# Altium schematic sheet RUMBA_V2.SchDoc
size 609 x 406 mm; PageSetup: Record=PageOptions|CenterHorizontal=True|CenterVertical=True|PrintScale=0.68|XCorrection=1.00|YCorrection=1.00|PrintKind=1|BorderSize=5000000|LeftOffset=0|BottomOffset=0|Orientation=2|PaperLength=1000|PaperWidth=1000|Scale=100|PaperSource=7|PrintQuality=-4|MediaType=1|DitherType=10|PaperKind=A3|PrintScaleMode=1
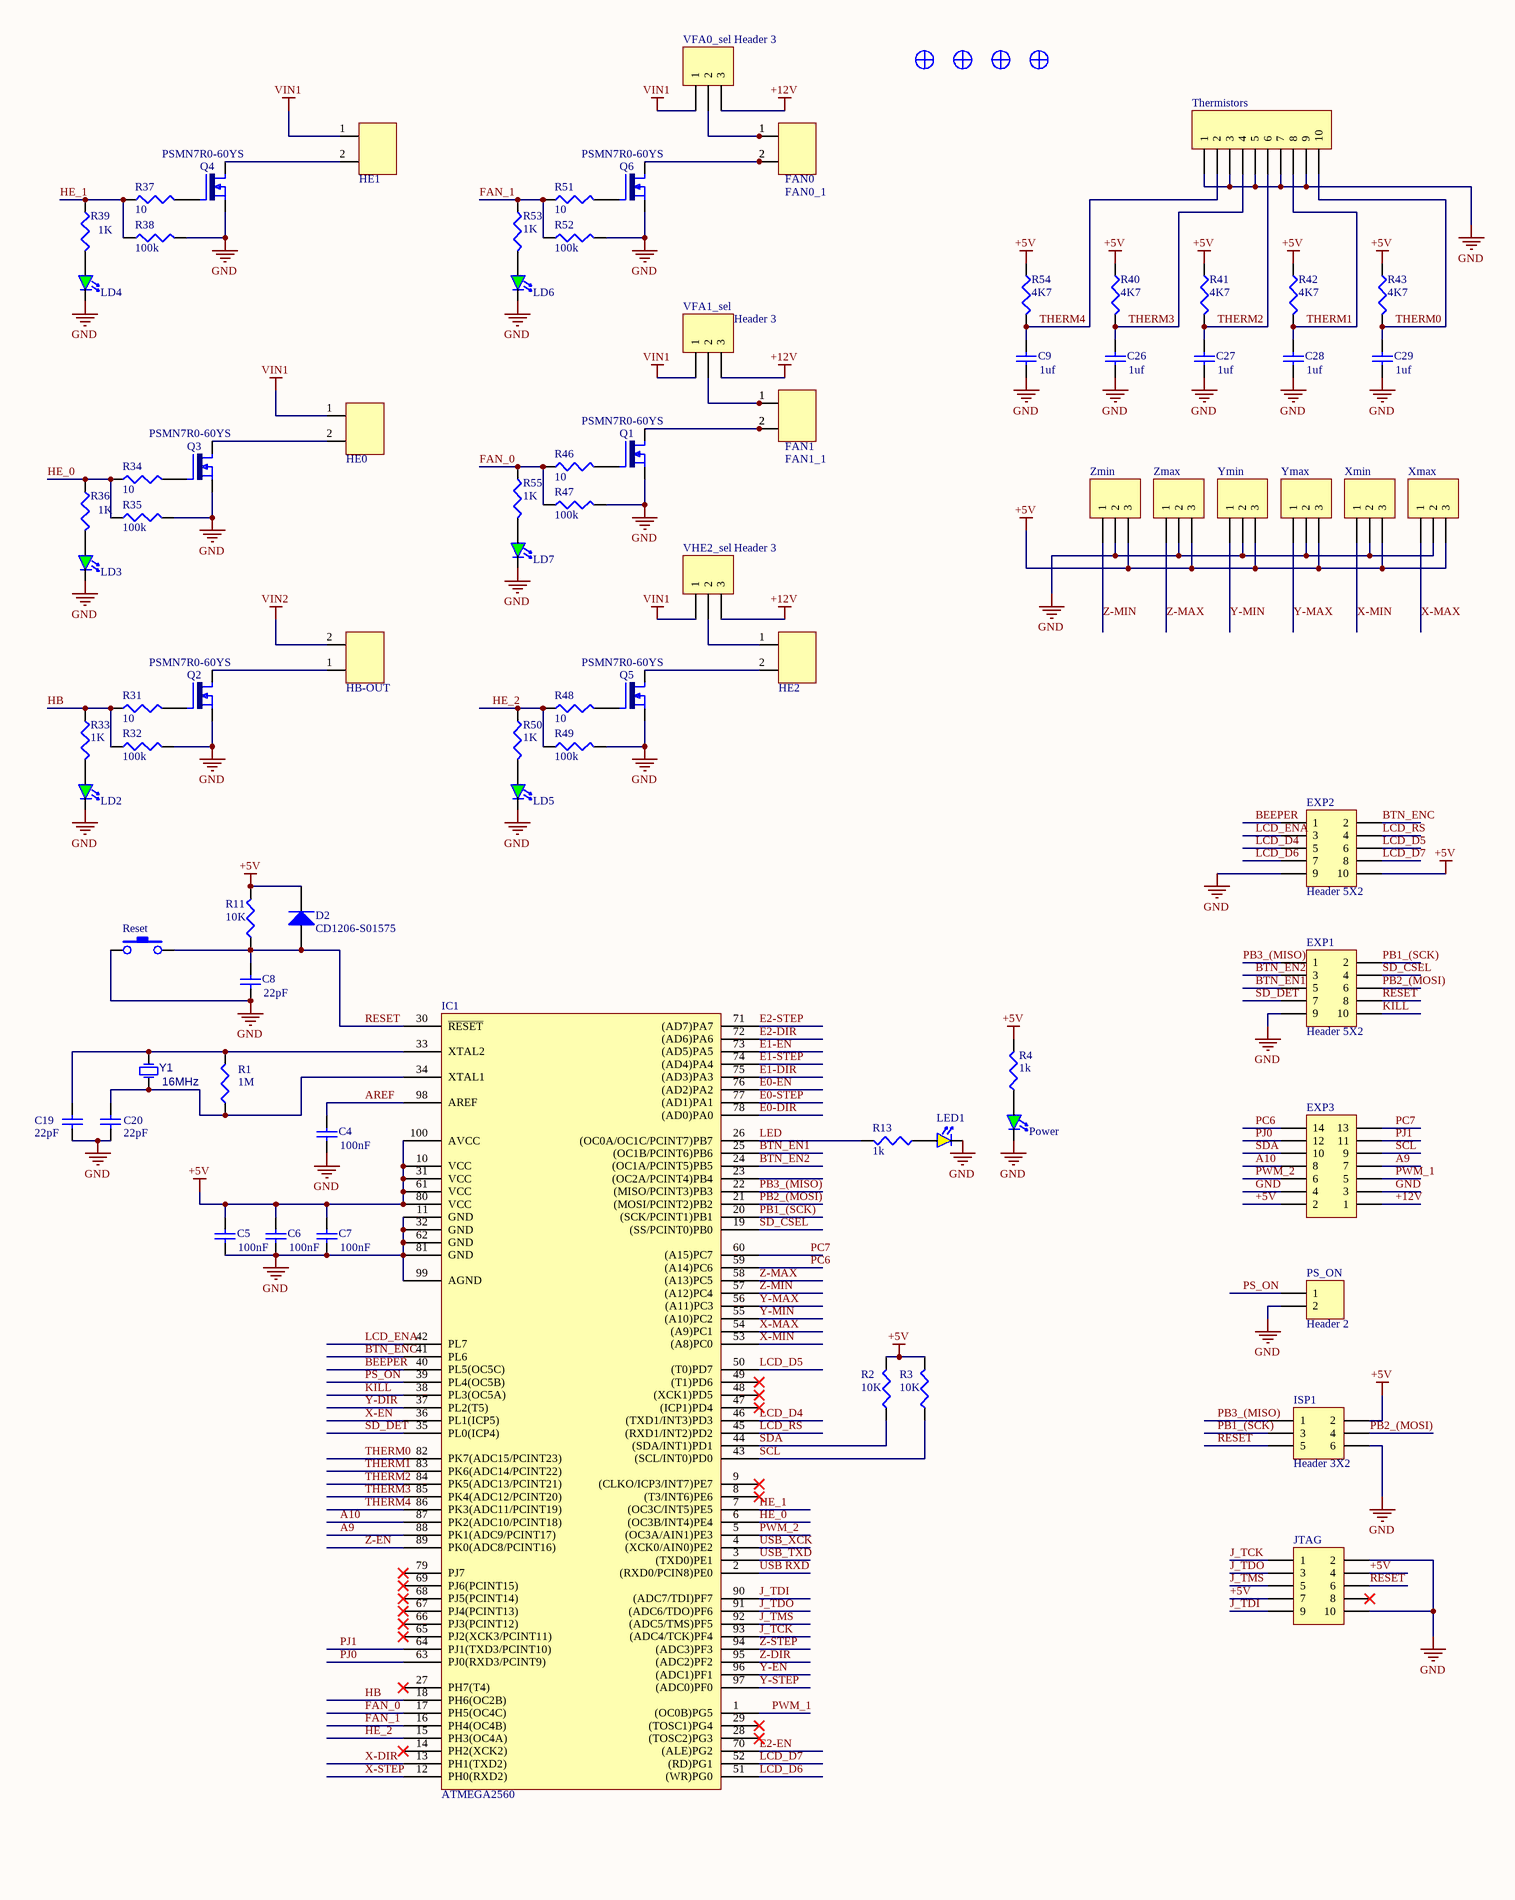
[diagram p0: RUMBA_V2.SchDoc, left]
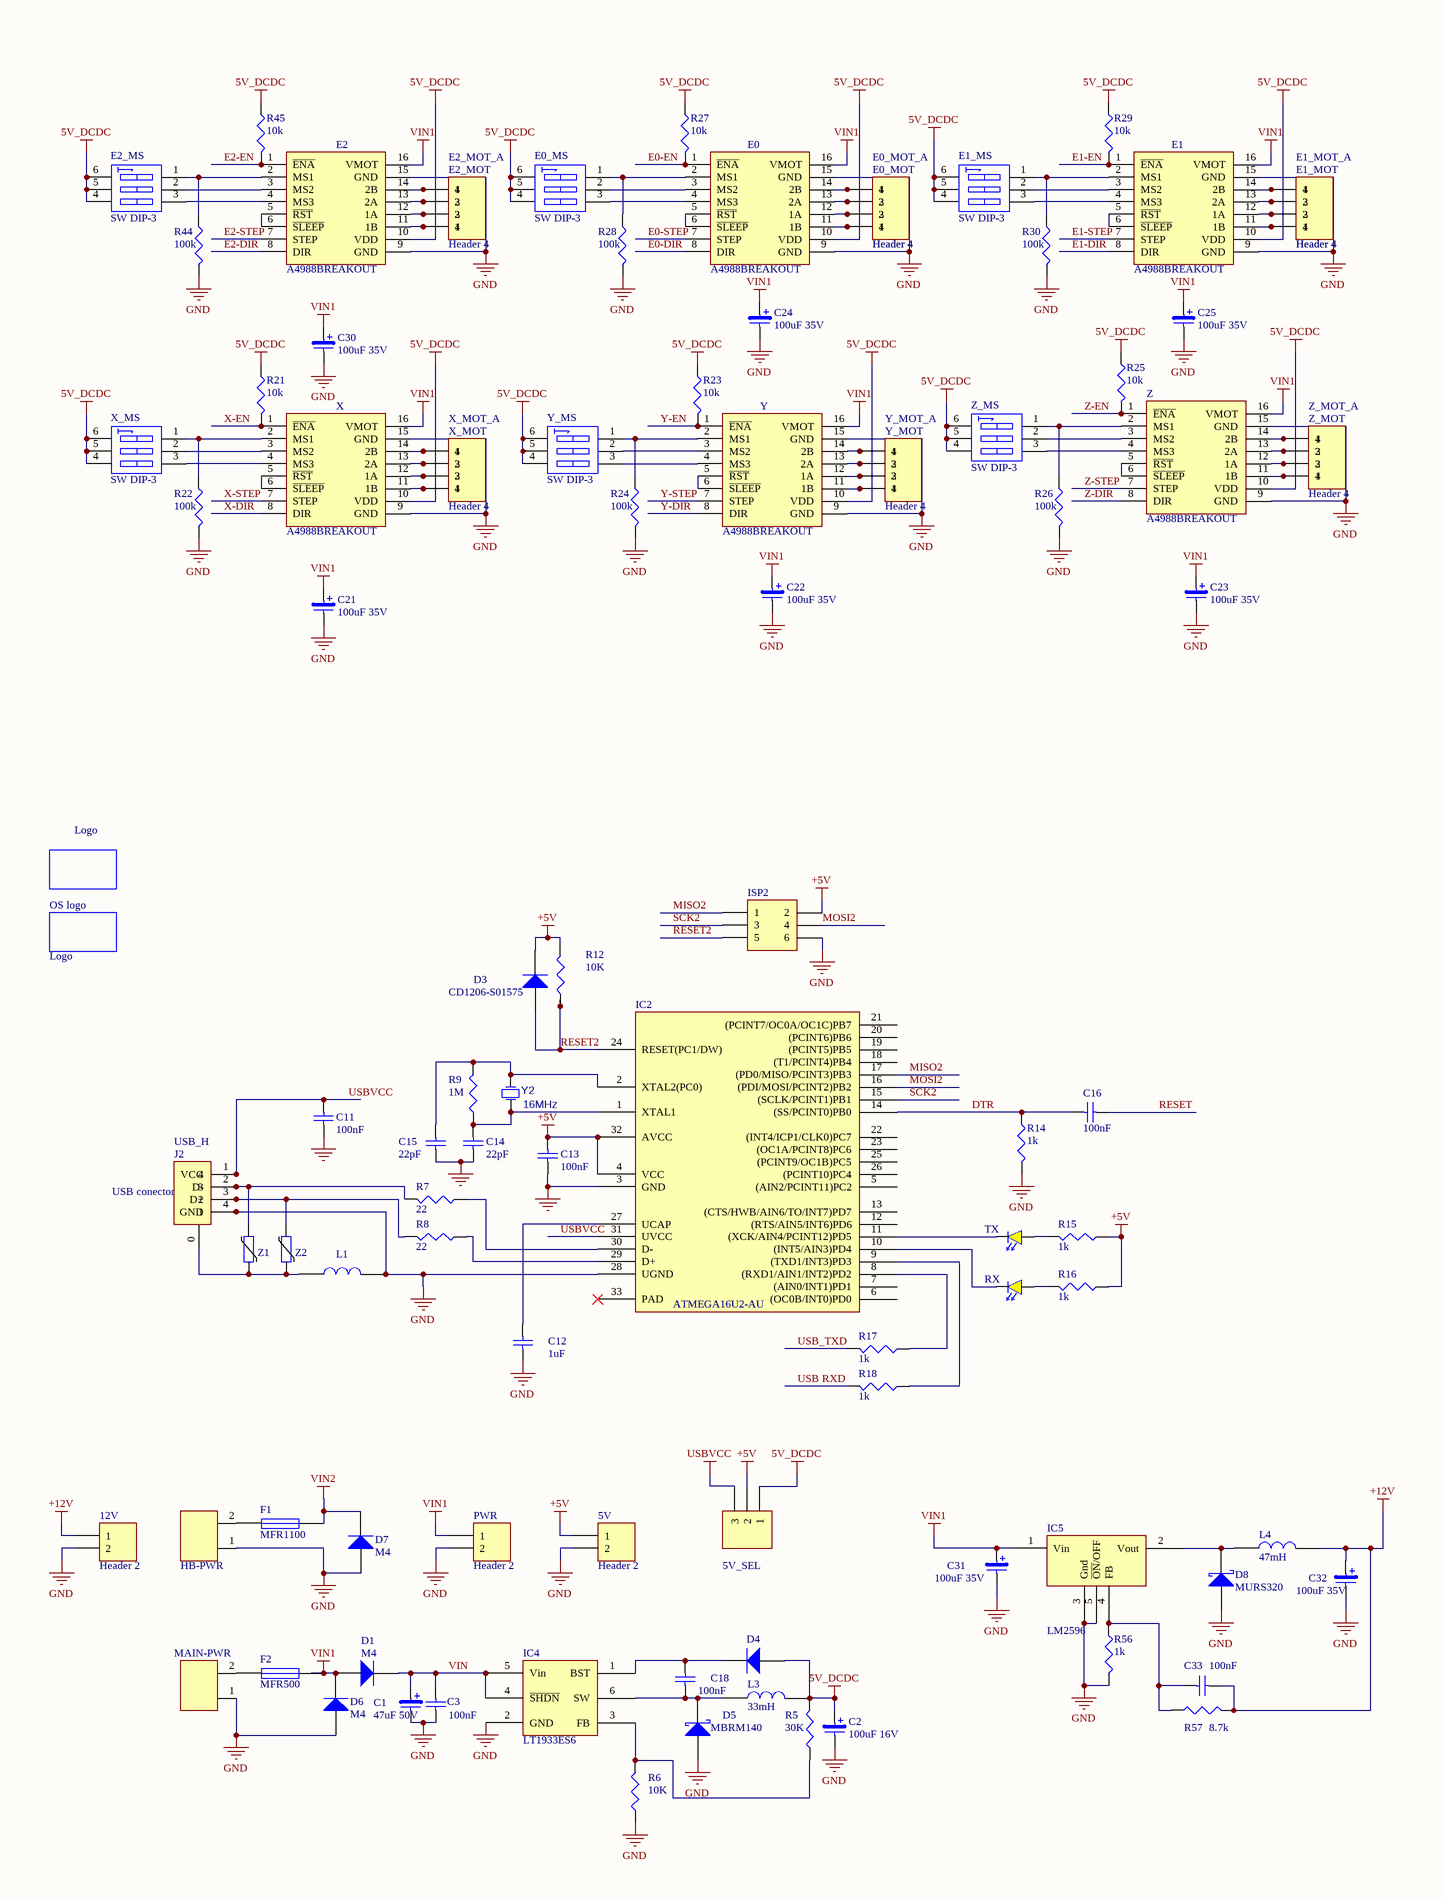
[diagram p1: RUMBA_V2.SchDoc, right]

## Parts
5V  Header 2  [HDR1X2]
5V_SEL  Header 3  [HDR1X3]  (value not drawn)
12V  Header 2  [HDR1X2]
C1  value 47uF 50V  [CAP EL PANASONIC]  (hidden comment: Cap Pol3)
C2  value 100uF 16V  [CAP EL PANASONIC]  (hidden comment: Cap Pol3)
C3  value 100nF  [Cap 1608-0603]  (hidden comment: Cap Semi)
C4  value 100nF  [Cap 1608-0603]  (hidden comment: Cap Semi)
C5  value 100nF  [Cap 1608-0603]  (hidden comment: Cap Semi)
C6  value 100nF  [Cap 1608-0603]  (hidden comment: Cap Semi)
C7  value 100nF  [Cap 1608-0603]  (hidden comment: Cap Semi)
C8  value 22pF  [Cap 1608-0603]  (hidden comment: Cap Semi)
C9  value 1uf  [Cap2012-0805]  (hidden comment: Cap Semi)
C11  value 100nF  [Cap 1608-0603]  (hidden comment: Cap Semi)
C12  value 1uF  [Cap 1608-0603]  (hidden comment: Cap Semi)
C13  value 100nF  [Cap 1608-0603]  (hidden comment: Cap Semi)
C14  value 22pF  [Cap 1608-0603]  (hidden comment: Cap Semi)
C15  value 22pF  [Cap 1608-0603]  (hidden comment: Cap Semi)
C16  value 100nF  [Cap 1608-0603]  (hidden comment: Cap Semi)
C18  value 100nF  [Cap 1608-0603]  (hidden comment: Cap Semi)
C19  value 22pF  [Cap 1608-0603]  (hidden comment: Cap Semi)
C20  value 22pF  [Cap 1608-0603]  (hidden comment: Cap Semi)
C21  value 100uF 35V  [CAP EL PANASONIC]  (hidden comment: Cap Pol3)
C22  value 100uF 35V  [CAP EL PANASONIC]  (hidden comment: Cap Pol3)
C23  value 100uF 35V  [CAP EL PANASONIC]  (hidden comment: Cap Pol3)
C24  value 100uF 35V  [CAP EL PANASONIC]  (hidden comment: Cap Pol3)
C25  value 100uF 35V  [CAP EL PANASONIC]  (hidden comment: Cap Pol3)
C26  value 1uf  [Cap2012-0805]  (hidden comment: Cap Semi)
C27  value 1uf  [Cap2012-0805]  (hidden comment: Cap Semi)
C28  value 1uf  [Cap2012-0805]  (hidden comment: Cap Semi)
C29  value 1uf  [Cap2012-0805]  (hidden comment: Cap Semi)
C30  value 100uF 35V  [CAP EL PANASONIC]  (hidden comment: Cap Pol3)
C31  value 100uF 35V  [CAP EL PANASONIC]  (hidden comment: Cap Pol3)
C32  value 100uF 35V  [CAP EL PANASONIC]  (hidden comment: Cap Pol3)
C33  value 100nF  [Cap 1608-0603]  (hidden comment: Cap Semi)
D1  M4  [1n4007 SMD]
D2  CD1206-S01575  [1N4148 SMD]
D3  CD1206-S01575  [1N4148 SMD]
D4  CD1206-S01575  [1N4148 SMD]  (value not drawn)
D5  value MBRM140  [MBRM140]  (hidden comment: Diode schottky)
D6  M4  [1n4007 SMD]
D7  M4  [1n4007 SMD]
D8  MURS320  [MURS320]
E0  A4988BREAKOUT  [A4988BREAKOUT]
E0_MOT  Header 4  [TERM4 3.5mm]
E0_MOT_A  Header 4  [HDR1X4]
E0_MS  SW DIP-3  [dipsw SO6]
E1  A4988BREAKOUT  [A4988BREAKOUT]
E1_MOT  Header 4  [TERM4 3.5mm]
E1_MOT_A  Header 4  [HDR1X4]
E1_MS  SW DIP-3  [dipsw SO6]
E2  A4988BREAKOUT  [A4988BREAKOUT]
E2_MOT  Header 4  [TERM4 3.5mm]  (value not drawn)
E2_MOT_A  Header 4  [HDR1X4]
E2_MS  SW DIP-3  [dipsw SO6]
EXP1  Header 5X2  [HDR2X5_exp Iner only\]
EXP2  Header 5X2  [HDR2X5_exp Iner only\]
EXP3  Header 7X2  [HDR2X7]  (value not drawn)
F1  MFR1100  [MFR500]
F2  MFR500  [MFR500]
FAN0  PORT 2 pina_0.2  [TERM2 3.5mm]  (value not drawn)
FAN0_1  PORT 2 pina_0.2  [HDR1X2]  (value not drawn)
FAN1  PORT 2 pina_0.2  [TERM2 3.5mm]  (value not drawn)
FAN1_1  PORT 2 pina_0.2  [HDR1X2]  (value not drawn)
HB-OUT  PORT 2 pina_0.2  [TERM2 5mm]  (value not drawn)
HB-PWR  PORT 2 pina_0.2  [TERM2 5mm]  (value not drawn)
HE0  PORT 2 pina_0.2  [TERM2 3.5mm]  (value not drawn)
HE1  PORT 2 pina_0.2  [TERM2 3.5mm]  (value not drawn)
HE2  PORT 2 pina_0.2  [TERM2 3.5mm]  (value not drawn)
IC1  ATMEGA2560  [TQFP100N]
IC2  ATMEGA16U2-AU  [TQFP32N]
IC4  LT1933ES6  [SOT23-6N]
IC5  LM2596  [TO-263]
ISP1  Header 3X2  [HDR2X3]
ISP2  Header 3X2  [HDR2X3]  (value not drawn)
J2  USB conector  [USB_mini/SM0.8-6H5]
JTAG  Header 5X2  [HDR2X5]  (value not drawn)
L1  Zavojnica  [Res 2012-0805]  (value not drawn)
L3  value 33mH  [inductor_mss6122d]  (hidden comment: Zavojnica)
L4  value 47mH  [DO3316P]  (hidden comment: Inductor)
LD2  GREEN  [LED 0805]  (value not drawn)
LD3  GREEN  [LED 0805]  (value not drawn)
LD4  GREEN  [LED 0805]  (value not drawn)
LD5  GREEN  [LED 0805]  (value not drawn)
LD6  GREEN  [LED 0805]  (value not drawn)
LD7  GREEN  [LED 0805]  (value not drawn)
LED1  YELLOW  [LED 0805]  (value not drawn)
Logo  Logo  [TAURINO LOGO HIGH]
MAIN-PWR  PORT 2 pina_0.2  [TERM2 5mm]  (value not drawn)
OS_logo  Logo  [OS LOGO TOP]
Power  GREEN  [LED 0805]  (value not drawn)
PS_ON  Header 2  [HDR1X2]
PWR  Header 2  [HDR1X2]
Q1  PSMN7R0-60YS  [LFPACK]
Q2  PSMN7R0-60YS  [LFPACK]
Q3  PSMN7R0-60YS  [LFPACK]
Q4  PSMN7R0-60YS  [LFPACK]
Q5  PSMN7R0-60YS  [LFPACK]
Q6  PSMN7R0-60YS  [LFPACK]
R1  value 1M  [RES 1608-0603]  (hidden comment: Res3)
R2  value 10K  [RES 1608-0603]  (hidden comment: Res3)
R3  value 10K  [RES 1608-0603]  (hidden comment: Res3)
R4  value 1k  [RES 1608-0603]  (hidden comment: Res3)
R5  value 30K  [RES 1608-0603]  (hidden comment: Res3)
R6  value 10K  [RES 1608-0603]  (hidden comment: Res3)
R7  value 22  [RES 1608-0603]  (hidden comment: Res3)
R8  value 22  [RES 1608-0603]  (hidden comment: Res3)
R9  value 1M  [RES 1608-0603]  (hidden comment: Res3)
R11  value 10K  [RES 1608-0603]  (hidden comment: Res3)
R12  value 10K  [RES 1608-0603]  (hidden comment: Res3)
R13  value 1k  [RES 1608-0603]  (hidden comment: Res3)
R14  value 1k  [RES 1608-0603]  (hidden comment: Res3)
R15  value 1k  [RES 1608-0603]  (hidden comment: Res3)
R16  value 1k  [RES 1608-0603]  (hidden comment: Res3)
R17  value 1k  [RES 1608-0603]  (hidden comment: Res3)
R18  value 1k  [RES 1608-0603]  (hidden comment: Res3)
R21  value 10k  [RES 1608-0603]  (hidden comment: Res3)
R22  value 100k  [RES 1608-0603]  (hidden comment: Res3)
R23  value 10k  [RES 1608-0603]  (hidden comment: Res3)
R24  value 100k  [RES 1608-0603]  (hidden comment: Res3)
R25  value 10k  [RES 1608-0603]  (hidden comment: Res3)
R26  value 100k  [RES 1608-0603]  (hidden comment: Res3)
R27  value 10k  [RES 1608-0603]  (hidden comment: Res3)
R28  value 100k  [RES 1608-0603]  (hidden comment: Res3)
R29  value 10k  [RES 1608-0603]  (hidden comment: Res3)
R30  value 100k  [RES 1608-0603]  (hidden comment: Res3)
R31  value 10  [RES 1608-0603]  (hidden comment: Res3)
R32  value 100k  [RES 1608-0603]  (hidden comment: Res3)
R33  value 1K  [RES 1608-0603]  (hidden comment: Res3)
R34  value 10  [RES 1608-0603]  (hidden comment: Res3)
R35  value 100k  [RES 1608-0603]  (hidden comment: Res3)
R36  value 1K  [RES 1608-0603]  (hidden comment: Res3)
R37  value 10  [RES 1608-0603]  (hidden comment: Res3)
R38  value 100k  [RES 1608-0603]  (hidden comment: Res3)
R39  value 1K  [RES 1608-0603]  (hidden comment: Res3)
R40  value 4K7  [RES 1608-0603]  (hidden comment: Res3)
R41  value 4K7  [RES 1608-0603]  (hidden comment: Res3)
R42  value 4K7  [RES 1608-0603]  (hidden comment: Res3)
R43  value 4K7  [RES 1608-0603]  (hidden comment: Res3)
R44  value 100k  [RES 1608-0603]  (hidden comment: Res3)
R45  value 10k  [RES 1608-0603]  (hidden comment: Res3)
R46  value 10  [RES 1608-0603]  (hidden comment: Res3)
R47  value 100k  [RES 1608-0603]  (hidden comment: Res3)
R48  value 10  [RES 1608-0603]  (hidden comment: Res3)
R49  value 100k  [RES 1608-0603]  (hidden comment: Res3)
R50  value 1K  [RES 1608-0603]  (hidden comment: Res3)
R51  value 10  [RES 1608-0603]  (hidden comment: Res3)
R52  value 100k  [RES 1608-0603]  (hidden comment: Res3)
R53  value 1K  [RES 1608-0603]  (hidden comment: Res3)
R54  value 4K7  [RES 1608-0603]  (hidden comment: Res3)
R55  value 1K  [RES 1608-0603]  (hidden comment: Res3)
R56  value 1k  [RES 1608-0603]  (hidden comment: Res3)
R57  value 8.7k  [RES 1608-0603]  (hidden comment: Res3)
Reset  (no value)  [SW-PB SMD 2pin]
RX  YELLOW  [LED 0805]  (value not drawn)
sc1  Sraf  [Sraf 3mm - rupa 3.2]  (value not drawn)
sc2  Sraf  [Sraf 3mm - rupa 3.2]  (value not drawn)
sc3  Sraf  [Sraf 3mm - rupa 3.5]  (value not drawn)
sc4  Sraf  [Sraf 3mm - rupa 3.5]  (value not drawn)
Thermistors  Header 10  [HDR1X10]  (value not drawn)
TX  YELLOW  [LED 0805]  (value not drawn)
USB_H  Header 4  [HDR1X4]  (value not drawn)
VFA0_sel  Header 3  [HDR1X3]
VFA1_sel  Header 3  [HDR1X3]
VHE2_sel  Header 3  [HDR1X3]
X  A4988BREAKOUT  [A4988BREAKOUT]
X_MOT  Header 4  [TERM4 3.5mm]  (value not drawn)
X_MOT_A  Header 4  [HDR1X4]
X_MS  SW DIP-3  [dipsw SO6]
Xmax  Header 3  [HDR1X3]  (value not drawn)
Xmin  Header 3  [HDR1X3]  (value not drawn)
Y  A4988BREAKOUT  [A4988BREAKOUT]
Y1  16MHz  [X-TAL]
Y2  16MHz  [X-TAL]
Y_MOT  Header 4  [TERM4 3.5mm]  (value not drawn)
Y_MOT_A  Header 4  [HDR1X4]
Y_MS  SW DIP-3  [dipsw SO6]
Ymax  Header 3  [HDR1X3]  (value not drawn)
Ymin  Header 3  [HDR1X3]  (value not drawn)
Z  A4988BREAKOUT  [A4988BREAKOUT]
Z1  VARISTOR  [RES 1608-0603]  (value not drawn)
Z2  VARISTOR  [RES 1608-0603]  (value not drawn)
Z_MOT  Header 4  [TERM4 3.5mm]  (value not drawn)
Z_MOT_A  Header 4  [HDR1X4]
Z_MS  SW DIP-3  [dipsw SO6]
Zmax  Header 3  [HDR1X3]  (value not drawn)
Zmin  Header 3  [HDR1X3]  (value not drawn)

## Nets
5V_DCDC: 5V_SEL.1 C2.1 D4.1(A) E0.10(VDD) E0_MS.4(B3) E0_MS.5(B2) E0_MS.6(B1) E1.10(VDD) E1_MS.4(B3) E1_MS.5(B2) E1_MS.6(B1) E2.10(VDD) E2_MS.4(B3) E2_MS.5(B2) E2_MS.6(B1) L3.2 R5.2 R21.1 R23.1 R25.1 R27.1 R29.1 R45.1 X.10(VDD) X_MS.4(B3) X_MS.5(B2) X_MS.6(B1) Y.10(VDD) Y_MS.4(B3) Y_MS.5(B2) Y_MS.6(B1) Z.10(VDD) Z_MS.4(B3) Z_MS.5(B2) Z_MS.6(B1)
+5V: 5V.1 5V_SEL.2 C5.2 C6.2 C7.2 C13.2 D2.2(K) D3.2(K) EXP2.10 EXP3.2 IC1.10(VCC) IC1.31(VCC) IC1.61(VCC) IC1.80(VCC) IC1.100(AVCC) IC2.4(VCC) IC2.32(AVCC) ISP1.2 ISP2.2 JTAG.4 JTAG.7 R2.2 R3.2 R4.2 R11.2 R12.2 R15.1 R16.1 R40.1 R41.1 R42.1 R43.1 R54.1 Xmax.3 Xmin.3 Ymax.3 Ymin.3 Zmax.3 Zmin.3
+12V: 12V.1 C32.1 C33.1 EXP3.1 L4.2 R57.2 VFA0_sel.3 VFA1_sel.3 VHE2_sel.3
GND: 5V.2 12V.2 C1.2 C2.2 C3.1 C4.1 C5.1 C6.1 C7.1 C8.1 C9.1 C11.1 C12.1 C13.1 C14.1 C15.1 C19.1 C20.1 C21.2 C22.2 C23.2 C24.2 C25.2 C26.1 C27.1 C28.1 C29.1 C30.2 C31.2 C32.2 D5.1(A) D6.1(A) D7.1(A) D8.1(A) E0.9(GND) E0.15(GND) E1.9(GND) E1.15(GND) E2.9(GND) E2.15(GND) EXP1.9 EXP2.9 EXP3.3 EXP3.4 HB-PWR.1 IC1.11(GND) IC1.32(GND) IC1.62(GND) IC1.81(GND) IC1.99(AGND) IC2.3(GND) IC2.28(UGND) IC4.2(GND) IC5.3(Gnd) IC5.5(~{ON}/OFF) IC5.6(HS) ISP1.6 ISP2.6 J2.4(GND) JTAG.2 JTAG.10 L1.2 LD2.2(K) LD3.2(K) LD4.2(K) LD5.2(K) LD6.2(K) LD7.2(K) LED1.2(K) MAIN-PWR.1 Power.2(K) PS_ON.2 PWR.2 Q1.3(S) Q2.3(S) Q3.3(S) Q4.3(S) Q5.3(S) Q6.3(S) R6.1 R14.2 R22.2 R24.2 R26.2 R28.2 R30.2 R32.2 R35.2 R38.2 R44.2 R47.2 R49.2 R52.2 R56.2 Reset.1 Thermistors.1 Thermistors.3 Thermistors.5 Thermistors.7 Thermistors.9 USB_H.1 X.9(GND) X.15(GND) Xmax.2 Xmin.2 Y.9(GND) Y.15(GND) Ymax.2 Ymin.2 Z.9(GND) Z.15(GND) Zmax.2 Zmin.2
USBVCC: 5V_SEL.3 C11.2 IC2.31(UVCC) J2.1(VCC) USB_H.4
VIN1: C21.1 C22.1 C23.1 C24.1 C25.1 C30.1 C31.1 D1.1(A) D6.2(K) E0.16(VMOT) E1.16(VMOT) E2.16(VMOT) F2.2 HE0.1 HE1.1 IC5.1(Vin) PWR.1 VFA0_sel.1 VFA1_sel.1 VHE2_sel.1 X.16(VMOT) Y.16(VMOT) Z.16(VMOT)
VIN2: D7.2(K) F1.2 HB-OUT.2
A9: EXP3.7 IC1.88(PK1(ADC9/PCINT17))
A10: EXP3.8 IC1.87(PK2(ADC10/PCINT18))
AREF: C4.2 IC1.98(AREF)
BEEPER: EXP2.1 IC1.40(PL5(OC5C))
BTN_EN1: EXP1.5 IC1.25((OC1B/PCINT6)PB6)
BTN_EN2: EXP1.3 IC1.24((OC1A/PCINT5)PB5)
BTN_ENC: EXP2.2 IC1.41(PL6)
DTR: C16.2 IC2.14((SS/PCINT0)PB0) R14.1
E0-DIR: E0.8(DIR) IC1.78((AD0)PA0)
E0-EN: E0.1(~{ENA}) IC1.76((AD2)PA2) R27.2
E0-STEP: E0.7(STEP) IC1.77((AD1)PA1)
E1-DIR: E1.8(DIR) IC1.75((AD3)PA3)
E1-EN: E1.1(~{ENA}) IC1.73((AD5)PA5) R29.2
E1-STEP: E1.7(STEP) IC1.74((AD4)PA4)
E2-DIR: E2.8(DIR) IC1.72((AD6)PA6)
E2-EN: E2.1(~{ENA}) IC1.70((ALE)PG2) R45.2
E2-STEP: E2.7(STEP) IC1.71((AD7)PA7)
FAN_0: IC1.17(PH5(OC4C)) R46.1 R47.1 R55.1
FAN_1: IC1.16(PH4(OC4B)) R51.1 R52.1 R53.1
HB: IC1.18(PH6(OC2B)) R31.1 R32.1 R33.1
HE_0: IC1.6((OC3B/INT4)PE4) R34.1 R35.1 R36.1
HE_1: IC1.7((OC3C/INT5)PE5) R37.1 R38.1 R39.1
HE_2: IC1.15(PH3(OC4A)) R48.1 R49.1 R50.1
J_TCK: IC1.93((ADC4/TCK)PF4) JTAG.1
J_TDI: IC1.90((ADC7/TDI)PF7) JTAG.9
J_TDO: IC1.91((ADC6/TDO)PF6) JTAG.3
J_TMS: IC1.92((ADC5/TMS)PF5) JTAG.5
KILL: EXP1.10 IC1.38(PL3(OC5A))
LCD_D4: EXP2.5 IC1.46((TXD1/INT3)PD3)
LCD_D5: EXP2.6 IC1.50((T0)PD7)
LCD_D6: EXP2.7 IC1.51((WR)PG0)
LCD_D7: EXP2.8 IC1.52((RD)PG1)
LCD_ENA: EXP2.3 IC1.42(PL7)
LCD_RS: EXP2.4 IC1.45((RXD1/INT2)PD2)
LED: IC1.26((OC0A/OC1C/PCINT7)PB7) R13.2
MISO2: IC2.17((PD0/MISO/PCINT3)PB3) ISP2.1
MOSI2: IC2.16((PDI/MOSI/PCINT2)PB2) ISP2.4
PB1_(SCK): EXP1.2 IC1.20((SCK/PCINT1)PB1) ISP1.3
PB2_(MOSI): EXP1.6 IC1.21((MOSI/PCINT2)PB2) ISP1.4
PB3_(MISO): EXP1.1 IC1.22((MISO/PCINT3)PB3) ISP1.1
PC6: EXP3.14 IC1.59((A14)PC6)
PC7: EXP3.13 IC1.60((A15)PC7)
PJ0: EXP3.12 IC1.63(PJ0(RXD3/PCINT9))
PJ1: EXP3.11 IC1.64(PJ1(TXD3/PCINT10))
PS_ON: IC1.39(PL4(OC5B)) PS_ON.1
PWM_1: EXP3.5 IC1.1((OC0B)PG5)
PWM_2: EXP3.6 IC1.5((OC3A/AIN1)PE3)
RESET: C8.2 C16.1 D2.1(A) EXP1.8 IC1.30(~{RESET}) ISP1.5 JTAG.6 R11.1 Reset.2
RESET2: D3.1(A) IC2.24(RESET(PC1/DW)) ISP2.5 R12.1
SCK2: IC2.15((SCLK/PCINT1)PB1) ISP2.3
SCL: EXP3.9 IC1.43((SCL/INT0)PD0) R3.1
SD_CSEL: EXP1.4 IC1.19((SS/PCINT0)PB0)
SD_DET: EXP1.7 IC1.35(PL0(ICP4))
SDA: EXP3.10 IC1.44((SDA/INT1)PD1) R2.1
THERM0: C29.2 IC1.82(PK7(ADC15/PCINT23)) R43.2 Thermistors.10
THERM1: C28.2 IC1.83(PK6(ADC14/PCINT22)) R42.2 Thermistors.8
THERM2: C27.2 IC1.84(PK5(ADC13/PCINT21)) R41.2 Thermistors.6
THERM3: C26.2 IC1.85(PK4(ADC12/PCINT20)) R40.2 Thermistors.4
THERM4: C9.2 IC1.86(PK3(ADC11/PCINT19)) R54.2 Thermistors.2
USB RXD: IC1.2((RXD0/PCIN8)PE0) R18.2
USB_TXD: IC1.3((TXD0)PE1) R17.2
USB_XCK: IC1.4((XCK0/AIN0)PE2)
VIN: C1.1 C3.2 D1.2(K) IC4.4(~{SHDN}) IC4.5(Vin)
X-DIR: IC1.13(PH1(TXD2)) X.8(DIR)
X-EN: IC1.36(PL1(ICP5)) R21.2 X.1(~{ENA})
X-MAX: IC1.54((A9)PC1) Xmax.1
X-MIN: IC1.53((A8)PC0) Xmin.1
X-STEP: IC1.12(PH0(RXD2)) X.7(STEP)
Y-DIR: IC1.37(PL2(T5)) Y.8(DIR)
Y-EN: IC1.96((ADC1)PF1) R23.2 Y.1(~{ENA})
Y-MAX: IC1.56((A11)PC3) Ymax.1
Y-MIN: IC1.55((A10)PC2) Ymin.1
Y-STEP: IC1.97((ADC0)PF0) Y.7(STEP)
Z-DIR: IC1.95((ADC2)PF2) Z.8(DIR)
Z-EN: IC1.89(PK0(ADC8/PCINT16)) R25.2 Z.1(~{ENA})
Z-MAX: IC1.58((A13)PC5) Zmax.1
Z-MIN: IC1.57((A12)PC4) Zmin.1
Z-STEP: IC1.94((ADC3)PF3) Z.7(STEP)
NetC12_2: C12.2 IC2.27(UCAP)
NetC14_2: C14.2 IC2.1(XTAL1) R9.1 Y2.1(OSC1)
NetC15_2: C15.2 IC2.2(XTAL2(PC0)) R9.2 Y2.2(OSC2)
NetC18_1: C18.1 D5.2(K) IC4.6(SW) L3.1
NetC18_2: C18.2 D4.2(K) IC4.1(BST)
NetC19_2: C19.2 IC1.33(XTAL2) R1.2 Y1.2(OSC2)
NetC20_2: C20.2 IC1.34(XTAL1) R1.1 Y1.1(OSC1)
NetC33_2: C33.2 IC5.4(FB) R56.1 R57.1
NetD8_2: D8.2(K) IC5.2(Vout) L4.1
NetE0_2: E0.2(MS1) E0_MS.1(A1) R28.1
NetE0_3: E0.3(MS2) E0_MS.2(A2)
NetE0_4: E0.4(MS3) E0_MS.3(A3)
NetE0_5: E0.5(~{RST}) E0.6(~{SLEEP})
NetE0_11: E0.11(1B) E0_MOT.1 E0_MOT_A.4
NetE0_12: E0.12(1A) E0_MOT.2 E0_MOT_A.3
NetE0_13: E0.13(2A) E0_MOT.3 E0_MOT_A.2
NetE0_14: E0.14(2B) E0_MOT.4 E0_MOT_A.1
NetE1_2: E1.2(MS1) E1_MS.1(A1) R30.1
NetE1_3: E1.3(MS2) E1_MS.2(A2)
NetE1_4: E1.4(MS3) E1_MS.3(A3)
NetE1_5: E1.5(~{RST}) E1.6(~{SLEEP})
NetE1_11: E1.11(1B) E1_MOT.1 E1_MOT_A.4
NetE1_12: E1.12(1A) E1_MOT.2 E1_MOT_A.3
NetE1_13: E1.13(2A) E1_MOT.3 E1_MOT_A.2
NetE1_14: E1.14(2B) E1_MOT.4 E1_MOT_A.1
NetE2_2: E2.2(MS1) E2_MS.1(A1) R44.1
NetE2_3: E2.3(MS2) E2_MS.2(A2)
NetE2_4: E2.4(MS3) E2_MS.3(A3)
NetE2_5: E2.5(~{RST}) E2.6(~{SLEEP})
NetE2_11: E2.11(1B) E2_MOT.1 E2_MOT_A.4
NetE2_12: E2.12(1A) E2_MOT.2 E2_MOT_A.3
NetE2_13: E2.13(2A) E2_MOT.3 E2_MOT_A.2
NetE2_14: E2.14(2B) E2_MOT.4 E2_MOT_A.1
NetF1_1: F1.1 HB-PWR.2
NetF2_1: F2.1 MAIN-PWR.2
NetFAN0_1: FAN0.1 FAN0_1.1 VFA0_sel.2
NetFAN0_2: FAN0.2 FAN0_1.2 Q6.2(D)
NetFAN1_1: FAN1.1 FAN1_1.1 VFA1_sel.2
NetFAN1_2: FAN1.2 FAN1_1.2 Q1.2(D)
NetHB-OUT_1: HB-OUT.1 Q2.2(D)
NetHE0_2: HE0.2 Q3.2(D)
NetHE1_2: HE1.2 Q4.2(D)
NetHE2_1: HE2.1 VHE2_sel.2
NetHE2_2: HE2.2 Q5.2(D)
NetIC2_8: IC2.8((RXD1/AIN1/INT2)PD2) R17.1
NetIC2_9: IC2.9((TXD1/INT3)PD3) R18.1
NetIC2_10: IC2.10((INT5/AIN3)PD4) RX.2(K)
NetIC2_11: IC2.11((XCK/AIN4/PCINT12)PD5) TX.2(K)
NetIC2_29: IC2.29(D+) R8.1
NetIC2_30: IC2.30(D-) R7.1
NetIC4_3: IC4.3(FB) R5.1 R6.2
NetJ2_0: J2.0 L1.1 Z1.2 Z2.2
NetJ2_2: J2.2(D-) R7.2 USB_H.3 Z1.1
NetJ2_3: J2.3(D+) R8.2 USB_H.2 Z2.1
NetLD2_1: LD2.1(A) R33.2
NetLD3_1: LD3.1(A) R36.2
NetLD4_1: LD4.1(A) R39.2
NetLD5_1: LD5.1(A) R50.2
NetLD6_1: LD6.1(A) R53.2
NetLD7_1: LD7.1(A) R55.2
NetLED1_1: LED1.1(A) R13.1
NetPower_1: Power.1(A) R4.1
NetQ1_1: Q1.1(G) R46.2
NetQ2_1: Q2.1(G) R31.2
NetQ3_1: Q3.1(G) R34.2
NetQ4_1: Q4.1(G) R37.2
NetQ5_1: Q5.1(G) R48.2
NetQ6_1: Q6.1(G) R51.2
NetR15_2: R15.2 TX.1(A)
NetR16_2: R16.2 RX.1(A)
NetR22_1: R22.1 X.2(MS1) X_MS.1(A1)
NetR24_1: R24.1 Y.2(MS1) Y_MS.1(A1)
NetR26_1: R26.1 Z.2(MS1) Z_MS.1(A1)
NetX_3: X.3(MS2) X_MS.2(A2)
NetX_4: X.4(MS3) X_MS.3(A3)
NetX_5: X.5(~{RST}) X.6(~{SLEEP})
NetX_11: X.11(1B) X_MOT.1 X_MOT_A.4
NetX_12: X.12(1A) X_MOT.2 X_MOT_A.3
NetX_13: X.13(2A) X_MOT.3 X_MOT_A.2
NetX_14: X.14(2B) X_MOT.4 X_MOT_A.1
NetY_3: Y.3(MS2) Y_MS.2(A2)
NetY_4: Y.4(MS3) Y_MS.3(A3)
NetY_5: Y.5(~{RST}) Y.6(~{SLEEP})
NetY_11: Y.11(1B) Y_MOT.1 Y_MOT_A.4
NetY_12: Y.12(1A) Y_MOT.2 Y_MOT_A.3
NetY_13: Y.13(2A) Y_MOT.3 Y_MOT_A.2
NetY_14: Y.14(2B) Y_MOT.4 Y_MOT_A.1
NetZ_3: Z.3(MS2) Z_MS.2(A2)
NetZ_4: Z.4(MS3) Z_MS.3(A3)
NetZ_5: Z.5(~{RST}) Z.6(~{SLEEP})
NetZ_11: Z.11(1B) Z_MOT.1 Z_MOT_A.4
NetZ_12: Z.12(1A) Z_MOT.2 Z_MOT_A.3
NetZ_13: Z.13(2A) Z_MOT.3 Z_MOT_A.2
NetZ_14: Z.14(2B) Z_MOT.4 Z_MOT_A.1

Not connected (* = marked no-connect by the designer): IC1 8((T3/INT6)PE6)* 9((CLKO/ICP3/INT7)PE7)* 14(PH2(XCK2))* 23((OC2A/PCINT4)PB4) 27(PH7(T4))* 28((TOSC2)PG3)* 29((TOSC1)PG4)* 47((ICP1)PD4)* 48((XCK1)PD5)* 49((T1)PD6)* 65(PJ2(XCK3/PCINT11))* 66(PJ3(PCINT12))* 67(PJ4(PCINT13))* 68(PJ5(PCINT14))* 69(PJ6(PCINT15))* 79(PJ7)*; IC2 5((AIN2/PCINT11)PC2) 6((OC0B/INT0)PD0) 7((AIN0/INT1)PD1) 12((RTS/AIN5/INT6)PD6) 13((CTS/HWB/AIN6/TO/INT7)PD7) 18((T1/PCINT4)PB4) 19((PCINT5)PB5) 20((PCINT6)PB6) 21((PCINT7/OC0A/OC1C)PB7) 22((INT4/ICP1/CLK0)PC7) 23((OC1A/PCINT8)PC6) 25((PCINT9/OC1B)PC5) 26((PCINT10)PC4) 33(PAD)*; JTAG 8*

## Library data of the parts
5V 12V PS_ON PWR = Header 2: Header, 2-Pin; LatestRevisionDate: 17-Jul-2002; LatestRevisionNote: Re-released for DXP Platform.; Publisher: Altium Limited
5V_SEL VFA0_sel VFA1_sel VHE2_sel Xmax Xmin Ymax Ymin Zmax Zmin = Header 3: Header, 3-Pin; LatestRevisionDate: 17-Jul-2002; LatestRevisionNote: Re-released for DXP Platform.; Publisher: Altium Limited
C1 C2 C21-C25 C30-C32 = Cap Pol3: Polarized Capacitor (Surface Mount); Published: 8-Jun-2000; Revision: July-2002: Re-released for DXP Platform.; Publisher: Altium Limited
C3-C9 C11-C16 C18-C20 C26-C29 C33 = Cap Semi: Capacitor (Semiconductor SIM Model); Published: 8-Jun-2000; Revision: July-2002: Re-released for DXP Platform.; Publisher: Altium Limited
D1-D4 D6 D7 = Diode: Default Diode; Code - JEDEC: DO-214-AB; Published: 8-Jun-2000; Revision: July-2002: Re-released for DXP Platform.; Publisher: Altium Limited
  D2-D4: value: CD1206-S01575
D5 D8 = Diode schottky: Default Diode; Code - JEDEC: DO-214-AB; Published: 8-Jun-2000; Revision: July-2002: Re-released for DXP Platform.; Publisher: Altium Limited
E0_MOT E0_MOT_A E1_MOT E1_MOT_A E2_MOT E2_MOT_A USB_H X_MOT X_MOT_A Y_MOT Y_MOT_A Z_MOT Z_MOT_A = Header 4: Header, 4-Pin; LatestRevisionDate: 17-Jul-2002; LatestRevisionNote: Re-released for DXP Platform.; Publisher: Altium Limited
E0_MS E1_MS E2_MS X_MS Y_MS Z_MS = SW DIP-3: DIP Switch; Published: 24-Mar-1999; Revision: July-2002: Re-released for DXP Platform.; Publisher: Altium Limited
EXP1 EXP2 JTAG = Header 5X2: Header, 5-Pin, Dual row; LatestRevisionDate: 17-Jul-2002; LatestRevisionNote: Re-released for DXP Platform.; Publisher: Altium Limited
EXP3 = Header 7X2: Header, 7-Pin, Dual row; LatestRevisionDate: 17-Jul-2002; LatestRevisionNote: Re-released for DXP Platform.; Publisher: Altium Limited
F1 F2 = Fuse 1: Fuse; Published: 8-Jun-2000; LatestRevisionDate: 17-Jul-2002; LatestRevisionNote: Re-released for DXP Platform.; PackageReference: PIN-W2/E2.8; Publisher: Altium Limited
IC1 = ATMEGA2560: The high-performance, low-power Atmel 8-bit AVR RISC-based microcontroller
IC2 = ATMEGA16U2-MU: High Performance, Low Power USB2.0 AVR® 8-Bit Microcontroller
IC4 = LT1933ES6: 600mA, 500kHz Step-Down  Switching Regulator in  SOT-23
IC5 = LM2596: 3.0 A, Step-Down Switching  Regulator
ISP1 ISP2 = Header 3X2: Header, 3-Pin, Dual row; LatestRevisionDate: 17-Jul-2002; LatestRevisionNote: Re-released for DXP Platform.; Publisher: Altium Limited
L1 = Zavojnica: MagneticCore Inductor with Winding Polarity Marking; Value: WE-CBF_0805 (WE-CBF); Published: 24-Mar-1999; Revision: July-2002: Re-released for DXP Platform.; Publisher: Altium Limited
L3 = Zavojnica: MagneticCore Inductor with Winding Polarity Marking; Published: 24-Mar-1999; Revision: July-2002: Re-released for DXP Platform.; Publisher: Altium Limited
L4 = Inductor: MagneticCore Inductor with Winding Polarity Marking; Published: 24-Mar-1999; Revision: July-2002: Re-released for DXP Platform.; Publisher: Altium Limited
LD2-LD7 Power = LEDG  0805: Hyper-Bright Low Current LED OSRAM
LED1 RX TX = LEDY  0805: Hyper-Bright Low Current LED OSRAM
Q1-Q6 = STP55NF06L
R1-R9 R11-R18 R21-R57 = Res3: Resistor; Published: 8-Jun-2000; Revision: July-2002: Re-released for DXP Platform.; Publisher: Altium Limited
Reset = SW-PB
Thermistors = Header 10: Header, 10-Pin; LatestRevisionDate: 17-Jul-2002; LatestRevisionNote: Re-released for DXP Platform.; Publisher: Altium Limited
Y1 Y2 = XTAL: Crystal Oscillator; Manufacturer: Generic Components; Published: 08/06/2000; Publisher: Altium Hobart Technology Centre; Class: Oscillator; SubClass: Crystal Oscillator
Z1 Z2 = VARISTOR: VARISTOR_CN0603 (VARISTOR); value: CG0603MLC-05E